# EAGLE design HW2 (EAGLE 7.5.0)
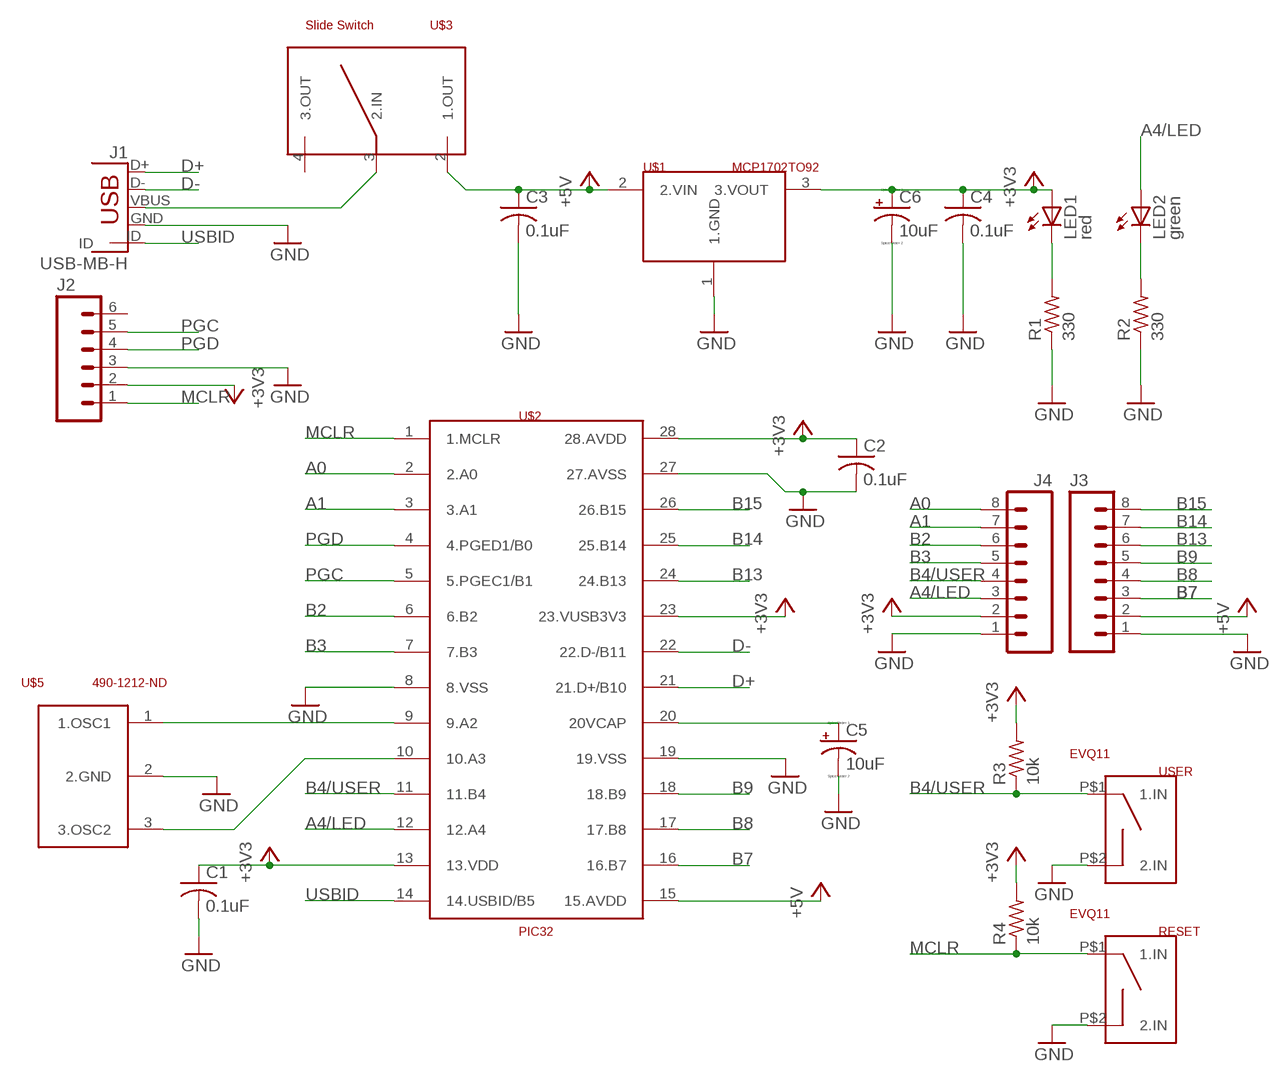
[diagram p0: schematic, sheet 1]

## Parts
C1  0.1uF  C-US025-024X044  [C025-024X044]
C2  0.1uF  C-US025-024X044  [C025-024X044]
C3  0.1uF  C-US025-024X044  [C025-024X044]
C4  0.1uF  C-US025-024X044  [C025-024X044]
C5  10uF  CPOL-USB45181A  [B45181A]
C6  10uF  CPOL-USB45181A  [B45181A]
J1  USB-MB-H  [USB-MB-H]
J2  M06SILK_FEMALE_PTH  [1X06]
J3  M08SILK_FEMALE_PTH  [1X08]
J4  M08SILK_FEMALE_PTH  [1X08]
LED1  red  LED3MM  [LED3MM]
LED2  green  LED3MM  [LED3MM]
R1  330  R-US_0204/7  [0204/7]
R2  330  R-US_0204/7  [0204/7]
R3  10k  R-US_0204/7  [0204/7]
R4  10k  R-US_0204/7  [0204/7]
RESET  EVQ11  [1X02_BIG]
U$1  MCP1702TO92  [TO92]
U$2  PIC32  [DIL28-3]
U$3  A107673-ND  [1X05_NO_SILK]
U$5  490-1212-ND  [1X03_NO_SILK]
USER  EVQ11  [1X02_BIG]

## Nets
+3V3: C1.1 C2.1 C4.1 C6.+ J2.2 J4.2 LED1.A R3.2 R4.2 U$1.3(3.VOUT) U$2.13(13.VDD) U$2.23(23.VUSB3V3) U$2.28(28.AVDD)
+5V: C3.1 J3.2 U$1.2(2.VIN) U$2.15(15.AVDD) U$3.2(1.OUT)
A0: J4.8 U$2.2(2.A0)
A1: J4.7 U$2.3(3.A1)
A4/LED: J4.3 LED2.A U$2.12(12.A4)
B2: J4.6 U$2.6(6.B2)
B3: J4.5 U$2.7(7.B3)
B4/USER: J4.4 R3.1 U$2.11(11.B4) USER.P$1(1.IN)
B7: J3.3 U$2.16(16.B7)
B8: J3.4 U$2.17(17.B8)
B9: J3.5 U$2.18(18.B9)
B13: J3.6 U$2.24(24.B13)
B14: J3.7 U$2.25(25.B14)
B15: J3.8 U$2.26(26.B15)
D+: J1.D+ U$2.21(21.D+/B10)
D-: J1.D- U$2.22(22.D-/B11)
GND: C1.2 C2.2 C3.2 C4.2 C5.- C6.- J1.GND J2.3 J3.1 J4.1 R1.1 R2.1 RESET.P$2(2.IN) U$1.1(1.GND) U$2.8(8.VSS) U$2.19(19.VSS) U$2.27(27.AVSS) U$5.2(2.GND) USER.P$2(2.IN)
MCLR: J2.1 R4.1 RESET.P$1(1.IN) U$2.1(1.MCLR)
N$1: J1.VBUS U$3.3(2.IN)
N$2: LED1.K(C) R1.2
N$3: LED2.K(C) R2.2
N$8: U$2.9(9.A2) U$5.1(1.OSC1)
N$9: U$2.10(10.A3) U$5.3(3.OSC2)
N$11: C5.+ U$2.20(20VCAP)
PGC: J2.5 U$2.5(5.PGEC1/B1)
PGD: J2.4 U$2.4(4.PGED1/B0)
USBID: J1.ID U$2.14(14.USBID/B5)
Unconnected: J2.6 U$3.4(3.OUT)

## Library data of the parts
C1-C4 = HW2:C-US: CAPACITOR, American symbol
C5 C6 = HW2:CPOL-US: POLARIZED CAPACITOR, American symbol
J1 = HW2:USB: USB Connectors USB-B-PTH is fully proven SKU : PRT-00139/CONN-08278 USB-miniB is fully proven SKU : PRT-00587 USB-A-PCB is untested. USB-A-H is throughly reviewed, but untested. Spark Fun Electronics SKU : PRT-00437 USB-B-SMT is throughly reviewed, but untested. Needs silkscreen touching up. USB-A-S has not been used/tested USB-MB-H has not been used/tested USB-MICROB has been used. CONN-09505
J2 = HW2:M06: Header 6 Standard 6-pin 0.1" header. Use with straight break away headers (SKU : PRT-00116), right angle break away headers (PRT-00553), swiss pins (PRT-00743), machine pins (PRT-00117), and female headers (PRT-00115). Molex polarized connector foot print use with SKU : PRT-08094 with associated crimp pins and housings. NOTES ON THE VARIANTS LOCK and LOCK_LONGPADS... This footprint was designed to help hold the alignment of a through-hole component (i.e. 6-pin header) while soldering it into place. You may notice that each hole has been shifted either up or down by 0.005 of an inch from it's more standard position (which is a perfectly straight line). This slight alteration caused the pins (the squares in the middle) to touch the edges of the holes. Because they are alternating, it causes a "brace" to hold the component in place. 0.005 has proven to be the perfect amount of "off-center" position when using our standard breakaway headers. Although looks a little odd when you look at the bare footprint, once you have a header in there, the alteration is very hard to notice. Also,if you push a header all the way into place, it is covered up entirely on the bottom side. This idea of altering the position of holes to aid alignment will be further integrated into the Sparkfun Library for other footprints. It can help hold any component with 3 or more connection pins.; PROD_ID: CONN-08437
J3 J4 = HW2:M08: Header 8 Standard 8-pin 0.1" header. Use with straight break away headers (SKU : PRT-00116), right angle break away headers (PRT-00553), swiss pins (PRT-00743), machine pins (PRT-00117), and female headers (PRT-00115).; PROD_ID: CONN-08438
LED1 LED2 = HW2:LED: LED OSRAM: - CHIPLED LG R971, LG N971, LY N971, LG Q971, LY Q971, LO R971, LY R971 LH N974, LH R974 LS Q976, LO Q976, LY Q976 LO Q996 - Hyper CHIPLED LW Q18S LB Q993, LB Q99A, LB R99A - SideLED LS A670, LO A670, LY A670, LG A670, LP A670 LB A673, LV A673, LT A673, LW A673 LH A674 LY A675 LS A676, LA A676, LO A676, LY A676, LW A676 LS A679, LY A679, LG A679 - Hyper Micro SIDELED® LS Y876, LA Y876, LO Y876, LY Y876 LT Y87S - SmartLED LW L88C, LW L88S LB L89C, LB L89S, LG L890 LS L89K, LO L89K, LY L89K LS L896, LA L896, LO L896, LY L896 - TOPLED LS T670, LO T670, LY T670, LG T670, LP T670 LSG T670, LSP T670, LSY T670, LOP T670, LYG T670 LG T671, LOG T671, LSG T671 LB T673, LV T673, LT T673, LW T673 LH T674 LS T676, LA T676, LO T676, LY T676, LB T676, LH T676, LSB T676, LW T676 LB T67C, LV T67C, LT T67C, LS T67K, LO T67K, LY T67K, LW E67C LS E67B, LA E67B, LO E67B, LY E67B, LB E67C, LV E67C, LT E67C LW T67C LS T679, LY T679, LG T679 LS T770, LO T770, LY T770, LG T770, LP T770 LB T773, LV T773, LT T773, LW T773 LH T774 LS E675, LA E675, LY E675, LS T675 LS T776, LA T776, LO T776, LY T776, LB T776 LHGB T686 LT T68C, LB T68C - Hyper Mini TOPLED® LB M676 - Mini TOPLED Santana® LG M470 LS M47K, LO M47K, LY M47K Source: http://www.osram.convergy.de LUXEON: - LUMILED® LXK2-PW12-R00, LXK2-PW12-S00, LXK2-PW14-U00, LXK2-PW14-V00 LXK2-PM12-R00, LXK2-PM12-S00, LXK2-PM14-U00 LXK2-PE12-Q00, LXK2-PE12-R00, LXK2-PE12-S00, LXK2-PE14-T00, LXK2-PE14-U00 LXK2-PB12-K00, LXK2-PB12-L00, LXK2-PB12-M00, LXK2-PB14-N00, LXK2-PB14-P00, LXK2-PB14-Q00 LXK2-PR12-L00, LXK2-PR12-M00, LXK2-PR14-Q00, LXK2-PR14-R00 LXK2-PD12-Q00, LXK2-PD12-R00, LXK2-PD12-S00 LXK2-PH12-R00, LXK2-PH12-S00 LXK2-PL12-P00, LXK2-PL12-Q00, LXK2-PL12-R00 Source: www.luxeon.com KINGBRIGHT: KA-3528ASYC Source: www.kingbright.com
R1-R4 = HW2:R-US_: RESISTOR, American symbol
RESET USER = HW2:EVQ11
U$1 = HW2:MCP1702
U$2 = HW2:PIC32
U$3 = HW2:A107673-ND
U$5 = HW2:490-1212-ND

## Board
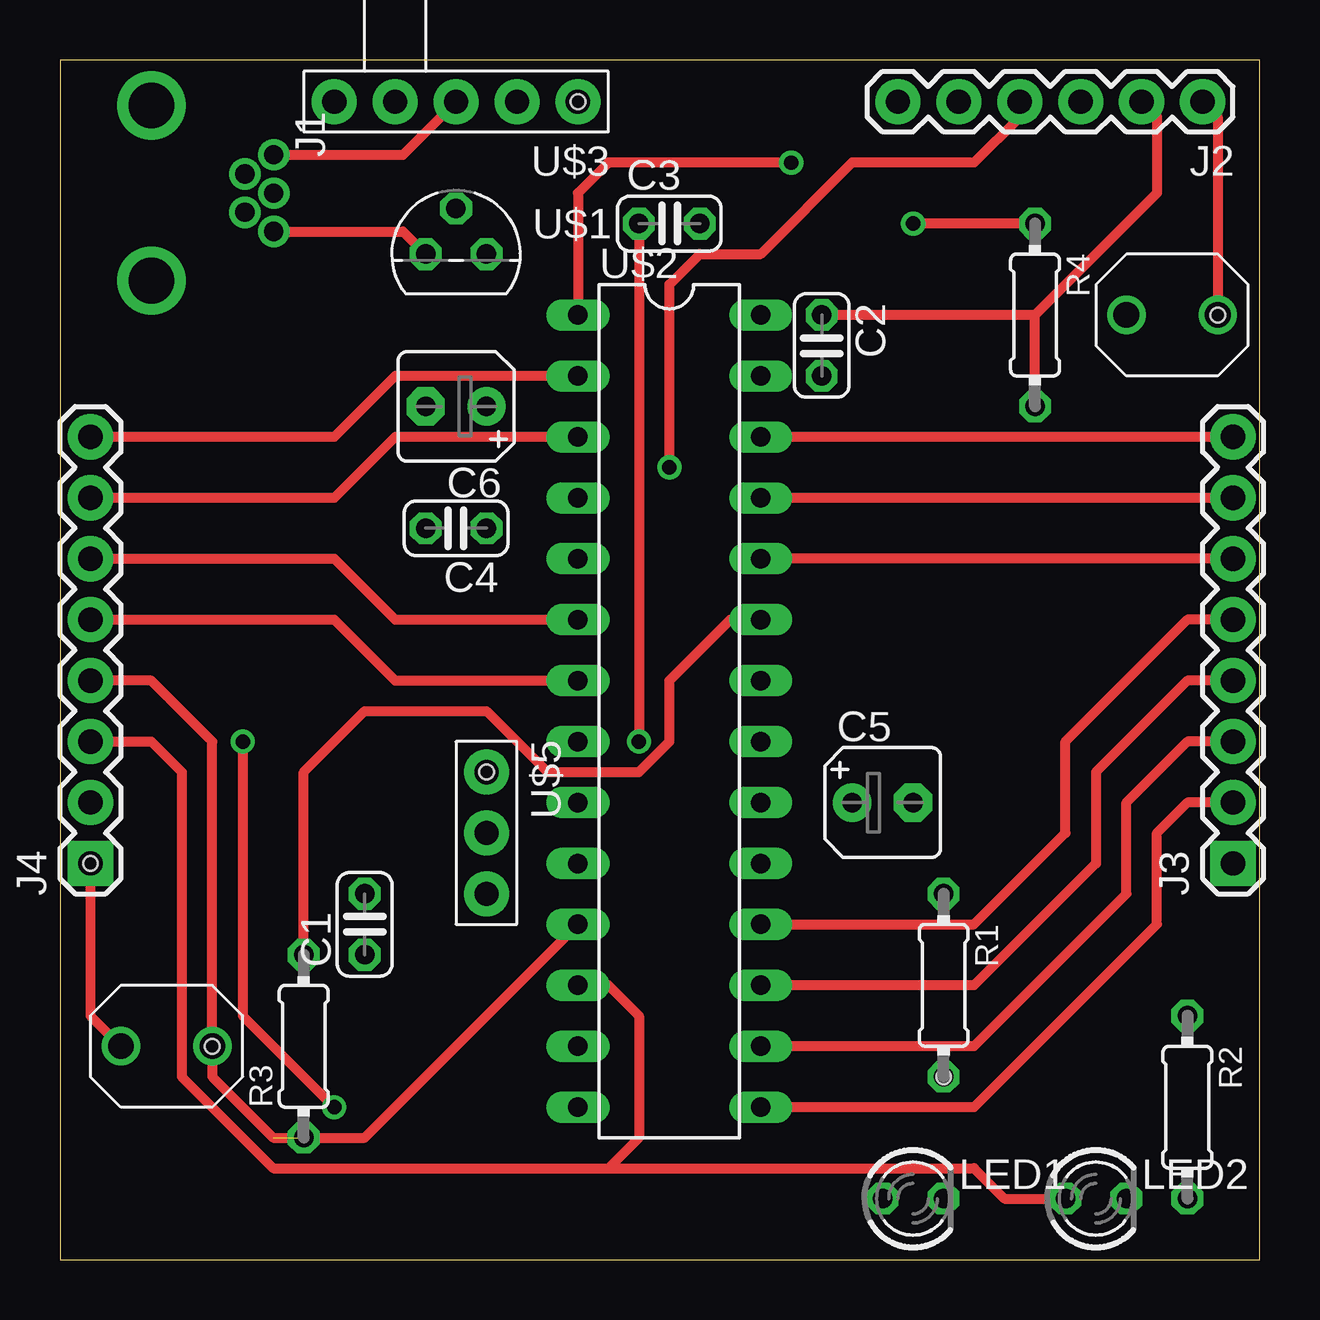
[diagram p1: board, top side]
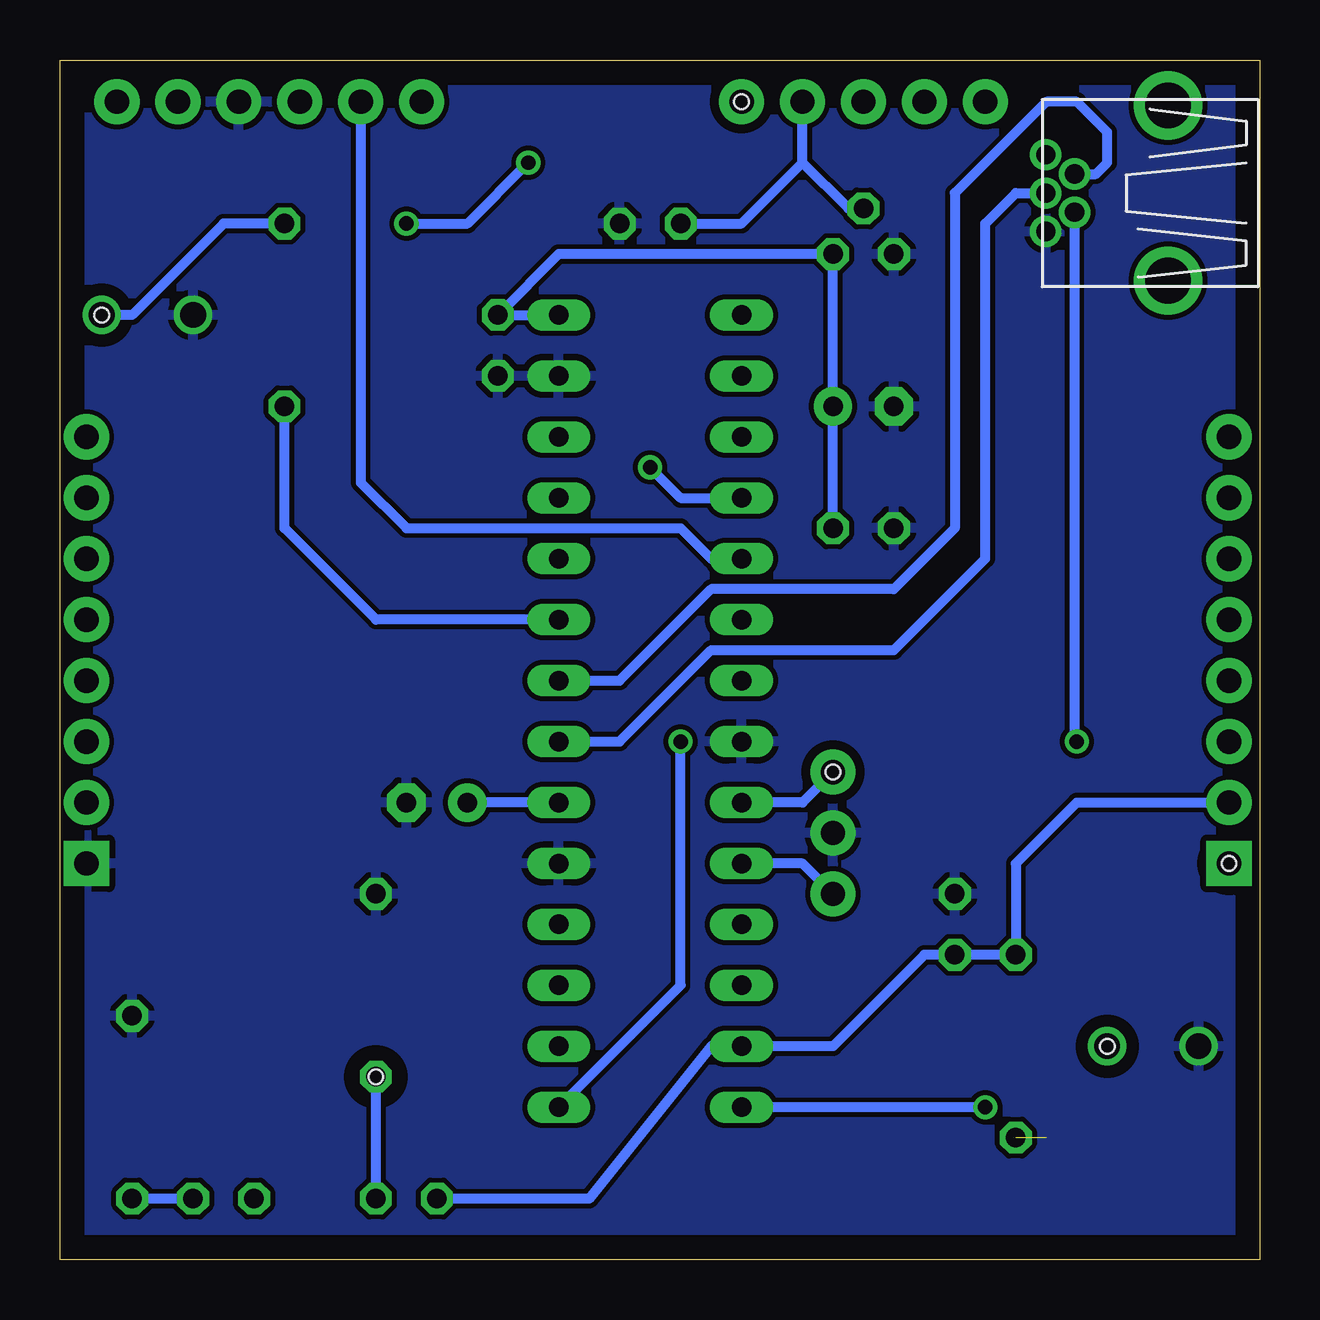
[diagram p2: board, bottom side, seen from below]

Size 50 x 50 mm. Coordinates in mm from the lower left corner, seen from the top.
Outline: 0,0 50,0 50,50 0,50 0,0
Copper layers (1*16): Top 0.035mm / dielectric 1.5mm / Bottom 0.035mm
Design rules "default": minimum track width 10mil, minimum drill 24mil, track to track 8mil, track to pad 8mil, pad to pad 8mil, via to via 8mil, smd to smd 8mil, copper to edge 40mil, drill to drill 8mil, minimum pad ring 10mil, minimum via ring 8mil, stop-mask expansion 4mil, vias tented up to drill 0mil, thermal gap 10mil
Holes 0.6 mm at 6.35,8.89 1.27,16.51 17.78,20.32 21.59,48.26 48.26,39.37 36.83,7.62

### Footprints (pad centres in the part's own frame; a part is rotated, then mirrored left to right if it is on the bottom)
C025-024X044 = drill 0.813 octagon: 1 -1.27,0; 2 1.27,0
B45181A = drill 0.813 pad 1.6: + -1.27,0 | drill 0.813 pad 1.6 octagon: - 1.27,0
USB-MB-H = drill 0.8: D+ 5.1,0; D- 3.9,0.8; GND 5.1,-1.6; ID 3.9,-0.8; VBUS 5.1,1.6 | drill 1.9: P$6 0,-3.65; P$7 0,3.65
1X06 = drill 1.016 pad 1.88: 1 0,0; 2 2.54,0; 3 5.08,0; 4 7.62,0; 5 10.16,0; 6 12.7,0
1X08 = drill 1.016 pad 1.88 square: 1 0,0 | drill 1.016 pad 1.88: 2 2.54,0; 3 5.08,0; 4 7.62,0; 5 10.16,0; 6 12.7,0; 7 15.24,0; 8 17.78,0
LED3MM = drill 0.813 octagon: A -1.27,0; K 1.27,0
0204/7 = drill 0.813 octagon: 1 -3.81,0; 2 3.81,0
1X02_BIG = drill 1.067: P$1 0,0; P$2 3.81,0
TO92 = drill 0.813 octagon: 1 -1.27,0; 2 0,1.905; 3 1.27,0
DIL28-3 = drill 0.813 long: 1 -16.51,-3.81; 2 -13.97,-3.81; 3 -11.43,-3.81; 4 -8.89,-3.81; 5 -6.35,-3.81; 6 -3.81,-3.81; 7 -1.27,-3.81; 8 1.27,-3.81; 9 3.81,-3.81; 10 6.35,-3.81; 11 8.89,-3.81; 12 11.43,-3.81; 13 13.97,-3.81; 14 16.51,-3.81; 15 16.51,3.81; 16 13.97,3.81; 17 11.43,3.81; 18 8.89,3.81; 19 6.35,3.81; 20 3.81,3.81; 21 1.27,3.81; 22 -1.27,3.81; 23 -3.81,3.81; 24 -6.35,3.81; 25 -8.89,3.81; 26 -11.43,3.81; 27 -13.97,3.81; 28 -16.51,3.81
1X05_NO_SILK = drill 1.016 pad 1.88: 1 0,0; 2 2.54,0; 3 5.08,0; 4 7.62,0; 5 10.16,0
1X03_NO_SILK = drill 1.016 pad 1.88: 1 0,0; 2 2.54,0; 3 5.08,0

### Placement (x,y rotation side)
C1  12.7,13.97 90 top
C2  31.75,38.1 270 top
C3  25.4,43.18 0 top
C4  16.51,30.48 180 top
C5  34.29,19.05 0 top
C6  16.51,35.56 180 top
J1  3.81,44.45 0 top
J2  47.62,48.26 180 top
J3  48.9,16.51 90 top
J4  1.27,16.51 90 top
LED1  35.56,2.54 0 top
LED2  43.18,2.54 0 top
R1  36.83,11.43 270 top
R2  46.99,6.35 270 top
R3  10.16,8.89 90 top
R4  40.64,39.37 270 top
RESET  48.26,39.37 180 top
U$1  16.51,41.91 0 top
U$2  25.4,22.86 270 top
U$3  21.59,48.26 180 top
U$5  17.78,20.32 270 top
USER  6.35,8.89 180 top

### Tracks (layer width: path | path; a pad name or v marks a point on that pad's centre or on a via)
+3V3  (via drill 0.6)
  Top 0.406: 40.64,36.83 R4.2 40.64,39.37 | 40.64,39.37 C2.1 | J2.2 45.72,47.62 45.72,44.45 40.64,39.37 | R3.2 10.16,20.32 12.7,22.86 17.78,22.86 20.32,20.32 24.13,20.32 25.4,21.59 25.4,24.13 27.94,26.67 U$2.23
  Bottom 0.406: C4.1 C6.+ U$1.3 29.21,41.91 C2.1 U$2.28 | J4.2 7.62,19.05 10.16,16.51 R3.2 C1.1 13.97,12.7 17.78,8.89 U$2.13 22.86,8.89 27.94,2.54 LED1.A | U$2.23 36.83,26.67 40.64,30.48 R4.2
  other vias: 10.16,12.7
+5V  (via drill 0.6)
  Top 0.406: J3.2 46.99,19.05 45.72,17.78 45.72,13.97 38.1,6.35 U$2.15 | C3.1 v24.13,21.59
  Bottom 0.406: U$1.2 17.14,43.81 19.05,45.72 | 19.05,45.72 U$3.2 | C3.1 21.59,43.18 19.05,45.72 | U$2.15 24.13,11.43 v24.13,21.59
A0
  Top 0.406: U$2.2 13.97,36.83 11.43,34.29 J4.8
A1
  Top 0.406: U$2.3 13.97,34.29 11.43,31.75 J4.7
A4/LED
  Top 0.406: J4.3 3.81,21.59 5.08,20.32 5.08,7.62 8.89,3.81 22.86,3.81 | 22.86,3.81 38.1,3.81 39.37,2.54 LED2.A | U$2.12 22.86,11.43 24.13,10.16 24.13,5.08 22.86,3.81
B2
  Top 0.406: J4.6 11.43,29.21 13.97,26.67 U$2.6
B3
  Top 0.406: J4.5 11.43,26.67 13.97,24.13 U$2.7
B4/USER  (1 unrouted)
  Top 0.406: J4.4 3.81,24.13 6.35,21.59 USER.P$1 6.35,7.62 8.89,5.08 12.7,5.08 U$2.11
B7
  Top 0.406: J3.3 46.99,21.59 44.45,19.05 44.45,15.24 38.1,8.89 U$2.16
B8
  Top 0.406: J3.4 46.99,24.13 43.18,20.32 43.18,16.51 38.1,11.43 U$2.17
B9
  Top 0.406: J3.5 46.99,26.67 41.91,21.59 41.91,17.78 38.1,13.97 U$2.18
B13
  Top 0.406: J3.6 U$2.24
B14
  Top 0.406: J3.7 U$2.25
B15
  Top 0.406: J3.8 U$2.26
D+
  Bottom 0.406: U$2.21 26.67,21.59 22.86,25.4 15.24,25.4 11.43,29.21 11.43,43.18 10.16,44.45 J1.D+
D-
  Bottom 0.406: U$2.22 26.67,24.13 22.86,27.94 15.24,27.94 12.7,30.48 12.7,44.45 8.89,48.26 7.62,48.26 6.35,46.99 6.35,45.72 6.82,45.25 J1.D-
GND
  Top 0.406: J1.GND 14.3,42.85 U$1.1 | J4.1 1.27,10.16 USER.P$2
  pour Bottom: 0,-2.54 54.61,-2.54 54.61,53.34 -1.27,53.34 -1.27,-2.54
MCLR  (via drill 0.6)
  Top 0.406: J2.1 48.26,47.62 RESET.P$1 | R4.1 v35.56,43.18 | v30.48,45.72 22.86,45.72 21.59,44.45 U$2.1
  Bottom 0.406: R4.1 43.18,43.18 46.99,39.37 RESET.P$1 | v35.56,43.18 33.02,43.18 v30.48,45.72
N$1
  Top 0.406: J1.VBUS 14.3,46.05 U$3.3
N$2
  Bottom 0.406: LED1.K R1.2
N$3
  Bottom 0.406: LED2.K R2.2
N$8
  Bottom 0.406: U$5.1 19.05,19.05 U$2.9
N$9
  Bottom 0.406: U$5.3 19.05,16.51 U$2.10
N$11
  Bottom 0.406: U$2.20 C5.+
PGC
  Bottom 0.406: U$2.5 22.86,29.21 24.13,30.48 35.56,30.48 37.47,32.38 J2.5
PGD  (via drill 0.6)
  Top 0.406: v25.4,33.02 25.4,40.64 26.67,41.91 29.21,41.91 33.02,45.72 38.1,45.72 40.01,47.62 J2.4
  Bottom 0.406: v25.4,33.02 24.13,31.75 U$2.4
USBID  (via drill 0.6)
  Top 0.406: v7.62,21.59 7.62,10.16 v11.43,6.35
  Bottom 0.406: J1.ID 7.71,21.68 v7.62,21.59 | v11.43,6.35 U$2.14

### Text on the board
tValues: RESET | A0 / A1 / B2 / B3 / B4 / A4 / 3.3V / GND | B15 / B14 / B13 / B9 / B8 / B7 / 5V / GND | USER | Nathan Corwin / Advanced Mechatronics